# EAGLE schematic proto2sch (EAGLE 9.4.2)
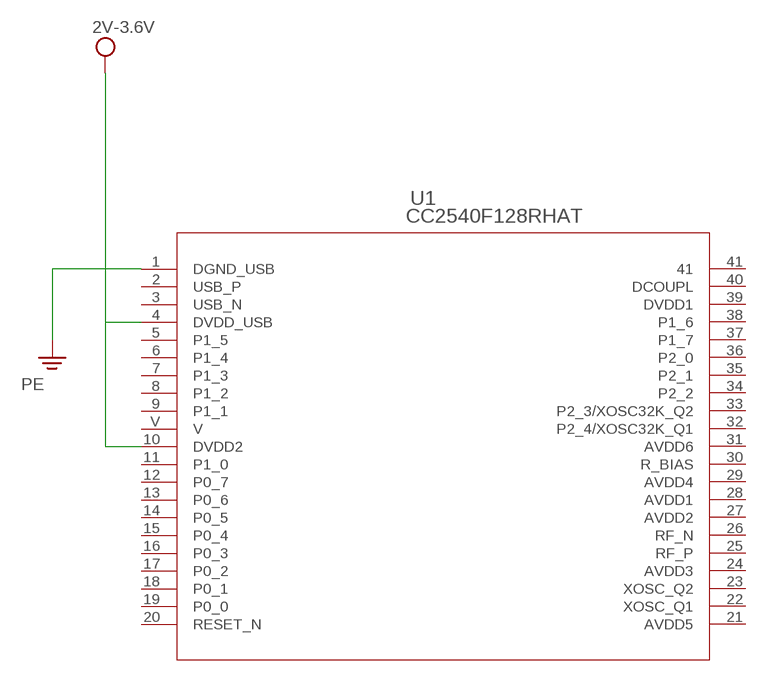
[diagram p0: schematic, sheet 1]

## Parts
U1  CC2540F128RHAT  [RHA40]

## Nets
PE: U1.1(DGND_USB)
VCC: U1.4(DVDD_USB) U1.10(DVDD2) ; supply symbol labelled 2V-3.6V
Unconnected: U1.2(USB_P) U1.3(USB_N) U1.5(P1_5) U1.6(P1_4) U1.7(P1_3) U1.8(P1_2) U1.9(P1_1) U1.11(P1_0) U1.12(P0_7) U1.13(P0_6) U1.14(P0_5) U1.15(P0_4) U1.16(P0_3) U1.17(P0_2) U1.18(P0_1) U1.19(P0_0) U1.20(RESET_N) U1.22(XOSC_Q1) U1.23(XOSC_Q2) U1.25(RF_P) U1.26(RF_N) U1.30(R_BIAS) U1.32(P2_4/XOSC32K_Q1) U1.33(P2_3/XOSC32K_Q2) U1.34(P2_2) U1.35(P2_1) U1.36(P2_0) U1.37(P1_7) U1.38(P1_6) U1.41 U1.V

## Power pins joined to a net without a drawn wire
AVDD1: U1.28(AVDD1)
AVDD2: U1.27(AVDD2)
AVDD3: U1.24(AVDD3)
AVDD4: U1.29(AVDD4)
AVDD5: U1.21(AVDD5)
AVDD6: U1.31(AVDD6)
DCOUPL: U1.40(DCOUPL)
DVDD1: U1.39(DVDD1)

## Library data of the parts
U1 = ticc2540:CC2540F128RHAT; MANUFACTURER_PART_NUMBER: CC2540F128RHAT; VENDOR: Texas Instruments